# EAGLE design stm32f100 (EAGLE 6.5.0)
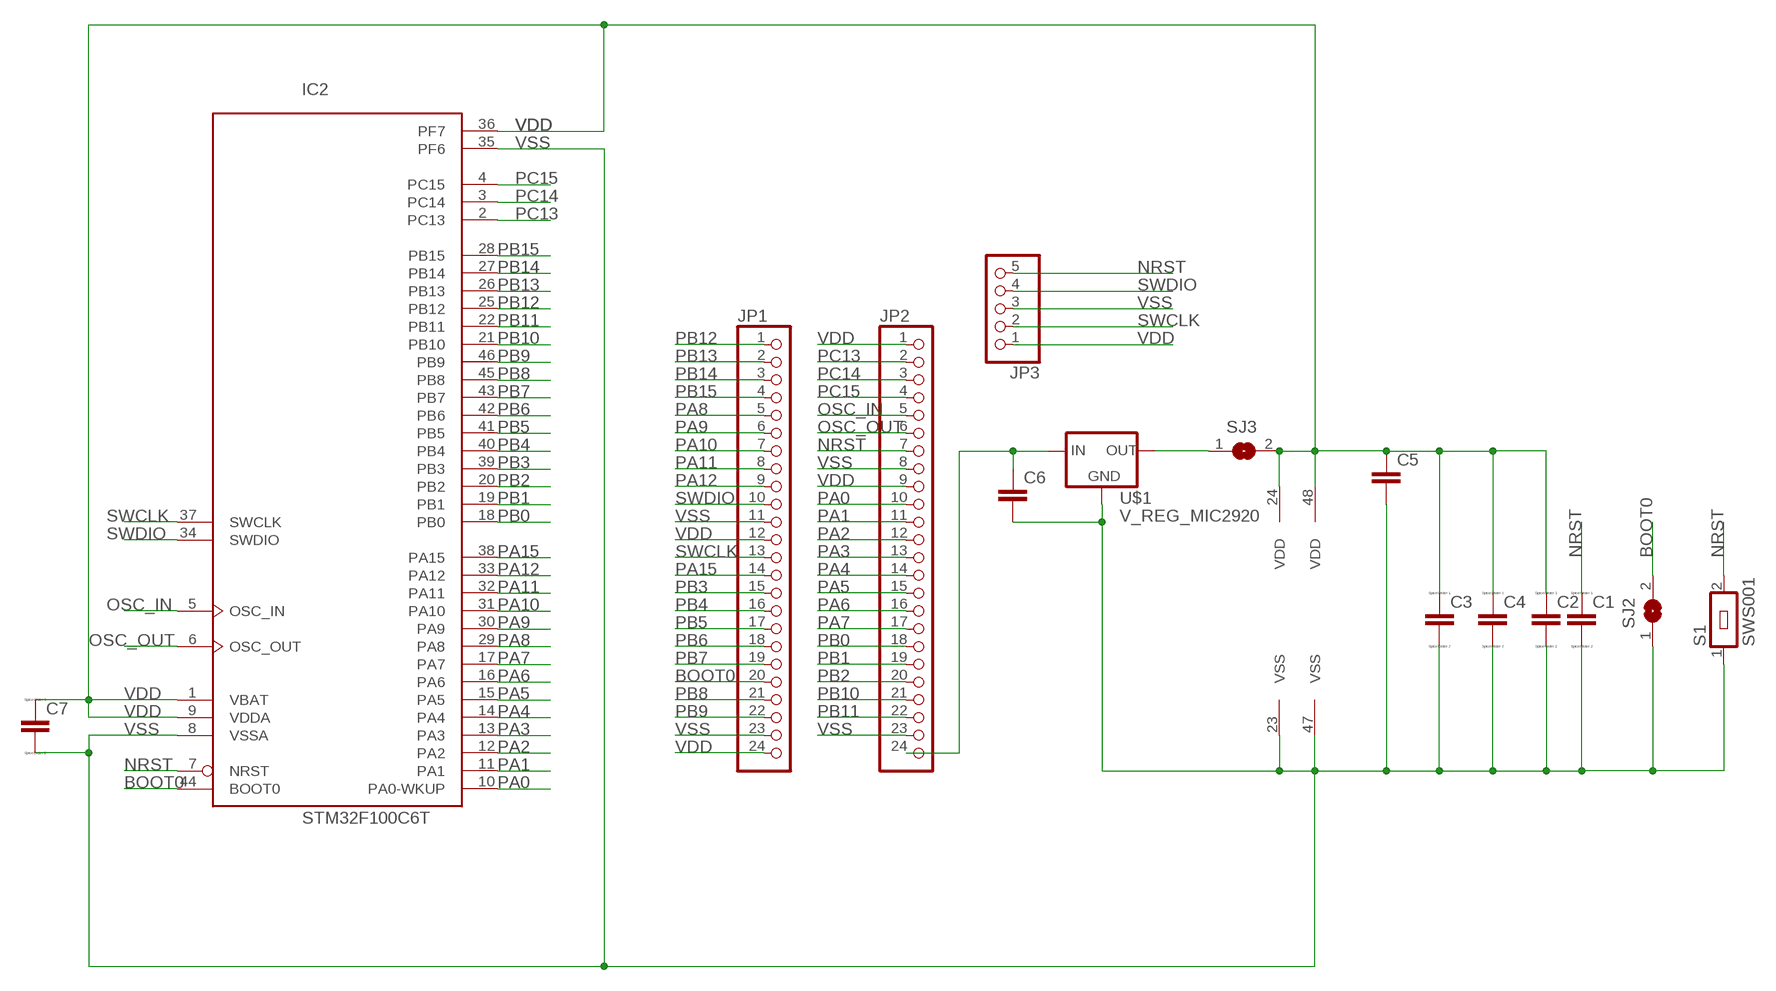
[diagram p0: schematic, sheet 1]

## Parts
C1  C-EUC0603K  [C0603K]
C2  C-EUC0603K  [C0603K]
C3  C-EUC0603K  [C0603K]
C4  C-EUC0603K  [C0603K]
C5  C-EUC1210K  [C1210K]
C6  C-EUC1210K  [C1210K]
C7  C-EUC0603K  [C0603K]
IC2  STM32F100C6T  [LQFP48]
JP1  PINHD-1X24  [1X24]
JP2  PINHD-1X24  [1X24]
JP3  PINHD-1X5  [1X05]
S1  SWS001  [SMS-001]
SJ2  SJ  [SJ]
SJ3  SJ  [SJ]
U$1  V_REG_MIC2920  [SOT223]

## Nets
BOOT0: IC2.44(BOOT0) JP1.20 SJ2.2
N$2: SJ3.1 U$1.2(OUT) U$1.4(OUT)
N$3: C6.1 JP2.24 U$1.3(IN)
NRST: C1.1 IC2.7(NRST) JP2.7 JP3.5 S1.2
OSC_IN: IC2.5(OSC_IN) JP2.5
OSC_OUT: IC2.6(OSC_OUT) JP2.6
PA0: IC2.10(PA0-WKUP) JP2.10
PA1: IC2.11(PA1) JP2.11
PA2: IC2.12(PA2) JP2.12
PA3: IC2.13(PA3) JP2.13
PA4: IC2.14(PA4) JP2.14
PA5: IC2.15(PA5) JP2.15
PA6: IC2.16(PA6) JP2.16
PA7: IC2.17(PA7) JP2.17
PA8: IC2.29(PA8) JP1.5
PA9: IC2.30(PA9) JP1.6
PA10: IC2.31(PA10) JP1.7
PA11: IC2.32(PA11) JP1.8
PA12: IC2.33(PA12) JP1.9
PA15: IC2.38(PA15) JP1.14
PB0: IC2.18(PB0) JP2.18
PB1: IC2.19(PB1) JP2.19
PB2: IC2.20(PB2) JP2.20
PB3: IC2.39(PB3) JP1.15
PB4: IC2.40(PB4) JP1.16
PB5: IC2.41(PB5) JP1.17
PB6: IC2.42(PB6) JP1.18
PB7: IC2.43(PB7) JP1.19
PB8: IC2.45(PB8) JP1.21
PB9: IC2.46(PB9) JP1.22
PB10: IC2.21(PB10) JP2.21
PB11: IC2.22(PB11) JP2.22
PB12: IC2.25(PB12) JP1.1
PB13: IC2.26(PB13) JP1.2
PB14: IC2.27(PB14) JP1.3
PB15: IC2.28(PB15) JP1.4
PC13: IC2.2(PC13) JP2.2
PC14: IC2.3(PC14) JP2.3
PC15: IC2.4(PC15) JP2.4
SWCLK: IC2.37(SWCLK) JP1.13 JP3.2
SWDIO: IC2.34(SWDIO) JP1.10 JP3.4
VDD: C2.1 C3.1 C4.1 C5.1 C7.1 IC2.1(VBAT) IC2.9(VDDA) IC2.24(VDD) IC2.36(PF7) IC2.48(VDD) JP1.12 JP1.24 JP2.1 JP2.9 JP3.1 SJ3.2
VSS: C1.2 C2.2 C3.2 C4.2 C5.2 C6.2 C7.2 IC2.8(VSSA) IC2.23(VSS) IC2.35(PF6) IC2.47(VSS) JP1.11 JP1.23 JP2.8 JP2.23 JP3.3 S1.1 SJ2.1 U$1.1(GND)

## Library data of the parts
C1-C4 C7 = resistor:C-EU: CAPACITOR, European symbol; SPICEPREFIX: C
C5 C6 = rcl:C-EU: CAPACITOR, European symbol
IC2 = reroolib:STM32F100C*T: ARM 32-bit Cortex™-M3 CPU 24 MHz maximum frequency 16 to 128 Kbytes of Flash memory 4 to 8 kbytes of SRAM 37 GPIOs 2.0 to 3.6 V application supply
JP1 JP2 = pinhead:PINHD-1X24: PIN HEADER
JP3 = pinhead:PINHD-1X5: PIN HEADER
S1 = wz:SWS001: SMD Dip Switch 1 pol.
SJ2 SJ3 = jumper:SJ: SMD solder JUMPER
U$1 = wz:V_REG_MIC2920: MIC2920A (http://www.micrel.com/_PDF/mic2920.pdf) - 400mA output LDO Regulator

## Board
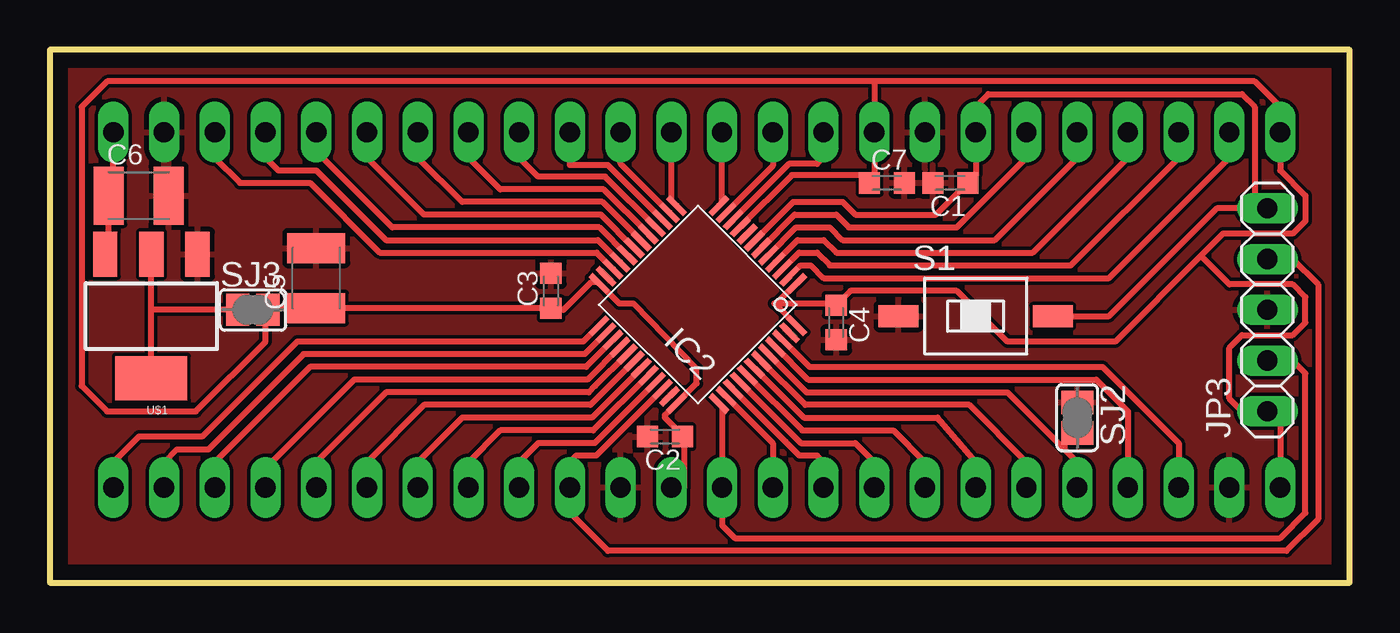
[diagram p1: board, top side]
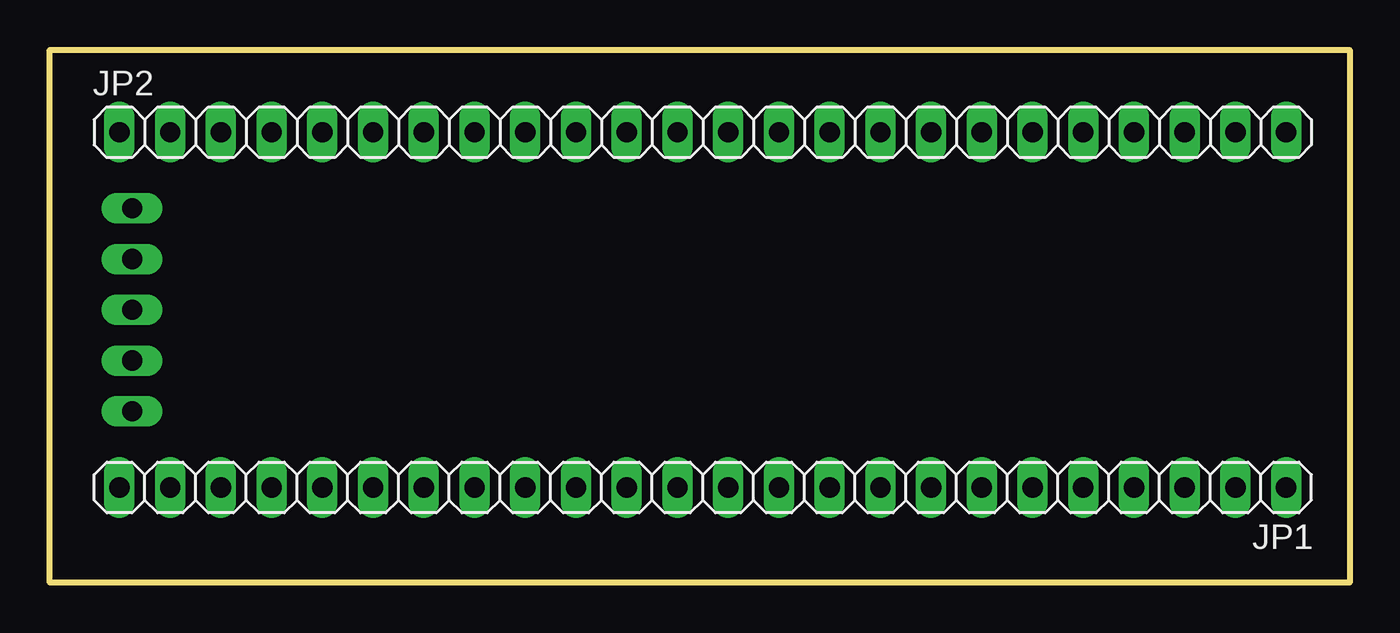
[diagram p2: board, bottom side, seen from below]

Size 65.08 x 26.66 mm. Coordinates in mm from the lower left corner, seen from the top.
Outline: 0,0 65.08,0 65.08,26.66 0,26.66 0,0
Copper layers (1*16): Top 0.035mm / dielectric 1.5mm / Bottom 0.035mm
Design rules "cnc *": minimum track width 10mil, minimum drill 0.1mm, track to track 7mil, track to pad 7mil, pad to pad 7mil, via to via 7mil, smd to smd 7mil, copper to edge 30mil, drill to drill 8mil, minimum pad ring 10mil, minimum via ring 8mil, stop-mask expansion 4mil, vias tented up to drill 0mil, thermal gap 10mil

### Footprints (pad centres in the part's own frame; a part is rotated, then mirrored left to right if it is on the bottom)
C0603K = smd 1.05 x 1.08: 1 -0.875,0; 2 0.875,0
C1210K = smd 1.5 x 2.9: 1 -1.5,0; 2 1.5,0
LQFP48 = smd 0.3 x 1.2: 1 -2.75,-4.25; 2 -2.25,-4.25; 3 -1.75,-4.25; 4 -1.25,-4.25; 5 -0.75,-4.25; 6 -0.25,-4.25; 7 0.25,-4.25; 8 0.75,-4.25; 9 1.25,-4.25; 10 1.75,-4.25; 11 2.25,-4.25; 12 2.75,-4.25; 25 2.75,4.25; 26 2.25,4.25; 27 1.75,4.25; 28 1.25,4.25; 29 0.75,4.25; 30 0.25,4.25; 31 -0.25,4.25; 32 -0.75,4.25; 33 -1.25,4.25; 34 -1.75,4.25; 35 -2.25,4.25; 36 -2.75,4.25 | smd 1.2 x 0.3: 13 4.25,-2.75; 14 4.25,-2.25; 15 4.25,-1.75; 16 4.25,-1.25; 17 4.25,-0.75; 18 4.25,-0.25; 19 4.25,0.25; 20 4.25,0.75; 21 4.25,1.25; 22 4.25,1.75; 23 4.25,2.25; 24 4.25,2.75; 37 -4.25,2.75; 38 -4.25,2.25; 39 -4.25,1.75; 40 -4.25,1.25; 41 -4.25,0.75; 42 -4.25,0.25; 43 -4.25,-0.25; 44 -4.25,-0.75; 45 -4.25,-1.25; 46 -4.25,-1.75; 47 -4.25,-2.25; 48 -4.25,-2.75
1X24 = drill 1.016 long: 1 -29.21,0; 2 -26.67,0; 3 -24.13,0; 4 -21.59,0; 5 -19.05,0; 6 -16.51,0; 7 -13.97,0; 8 -11.43,0; 9 -8.89,0; 10 -6.35,0; 11 -3.81,0; 12 -1.27,0; 13 1.27,0; 14 3.81,0; 15 6.35,0; 16 8.89,0; 17 11.43,0; 18 13.97,0; 19 16.51,0; 20 19.05,0; 21 21.59,0; 22 24.13,0; 23 26.67,0; 24 29.21,0
1X05 = drill 1.016 long: 1 -5.08,0; 2 -2.54,0; 3 0,0; 4 2.54,0; 5 5.08,0
SMS-001 = smd 1.092 x 2.007: 1 0,-3.861; 2 0,3.861
SJ = smd 1.168 x 1.6: 1 -0.762,0; 2 0.762,0
SOT223 = smd 1.219 x 2.235: 1 -2.311,-3.099; 2 0,-3.099; 3 2.311,-3.099 | smd 3.6 x 2.2: 4 0,3.099

### Placement (x,y rotation side)
C1  45.09,20 180 top
C2  30.8,7.3 180 top
C3  25.08,14.61 90 top
C4  39.37,13.02 270 top
C5  13.34,15.24 90 top
C6  4.45,19.37 0 top
C7  41.91,20 0 top
IC2  32.44,13.92 135 top
JP1  32.38,4.76 180 bottom
JP2  32.38,22.54 0 bottom
JP3  60.96,13.65 90 top
S1  46.35,13.34 270 top
SJ2  51.44,8.26 270 top
SJ3  10.16,13.65 0 top
U$1  5.08,13.34 180 top

### Tracks (layer width: path | path; a pad name or v marks a point on that pad's centre or on a via)
BOOT0
  Top 0.305: IC2.44 37.89,9.53 47.94,9.53 50.8,6.67 | JP1.20 51.44,6.03 50.8,6.67 | SJ2.2 50.8,7.49 50.8,6.67
N$1
  Top 0.305: 51.44,8.89 51.44,7.62
N$2
  Top 0.305: U$1.4 5.08,13.65 | 5.08,13.65 U$1.2 | SJ3.1 5.08,13.65
N$3
  Top 0.305: U$1.3 2.94,16.29 C6.1 3.17,19.6 JP2.24
NRST
  Top 0.305: IC2.7 37.22,19.05 39.69,19.05 40.32,18.41 44.37,18.41 C1.1 46.35,20.4 JP2.7 46.35,23.81 46.99,24.45 59.69,24.45 60.33,23.81 60.33,18.73 | JP3.5 60.33,18.73 | 60.33,18.73 58.42,18.73 53.02,13.34 S1.2
OSC_IN
  Top 0.305: JP2.5 51.44,21.27 47.31,17.14 39.69,17.14 39.05,17.78 37.37,17.78 IC2.5
OSC_OUT
  Top 0.305: JP2.6 48.9,21.27 45.4,17.78 40.01,17.78 39.37,18.41 37.29,18.41 IC2.6
PA0
  Top 0.305: JP2.10 38.73,21.27 38.42,20.95 37,20.95 IC2.10
PA1
  Top 0.305: JP2.11 36.2,20.85 IC2.11
PA2
  Top 0.305: JP2.12 33.66,19.02 IC2.12
PA3
  Top 0.305: JP2.13 31.11,19.13 IC2.13
PA4
  Top 0.305: JP2.14 28.57,20.96 IC2.14
PA5
  Top 0.305: JP2.15 26.04,20.89 27.94,20.89 IC2.15
PA6
  Top 0.305: 27.8,20.32 24.45,20.32 23.5,21.27 JP2.16 | IC2.16 27.8,20.32 | 27.8,20.32
PA7
  Top 0.305: 27.73,19.68 22.54,19.68 20.95,21.27 JP2.17 | IC2.17 27.73,19.68 | 27.73,19.68
PA8
  Top 0.305: JP1.5 13.34,6.03 16.83,9.53 26.99,9.53 27.31,9.84 IC2.29
PA9
  Top 0.305: JP1.6 15.88,6.03 18.73,8.89 27.06,8.89 IC2.30
PA10
  Top 0.305: JP1.7 18.41,6.03 20.64,8.26 27.13,8.26 IC2.31
PA11
  Top 0.305: JP1.8 20.95,6.03 22.54,7.62 27.2,7.62 IC2.32
PA12
  Top 0.305: JP1.9 23.5,6.03 24.45,6.99 27.28,6.99 IC2.33
PA15
  Top 0.305: 36.2,5.39 JP1.14 | IC2.38 36.2,6.99 36.2,5.39 | 36.2,5.39
PB0
  Top 0.305: 27.66,19.05 20.64,19.05 18.41,21.27 JP2.18 | IC2.18 27.66,19.05 | 27.66,19.05
PB1
  Top 0.305: 27.59,18.41 18.73,18.41 15.88,21.27 JP2.19 | IC2.19 27.59,18.41 | 27.59,18.41
PB2
  Top 0.305: 27.51,17.78 17.14,17.78 13.34,21.59 JP2.20 | IC2.20 27.51,17.78 | 27.51,17.78
PB3
  Top 0.305: JP1.15 38.73,6.03 38.42,6.35 37.53,6.35 37.15,6.73 36.83,7.05 IC2.39
PB4
  Top 0.305: JP1.16 41.27,6.03 40.32,6.99 37.6,6.99 IC2.40
PB5
  Top 0.305: JP1.17 43.81,6.03 42.23,7.62 37.67,7.62 IC2.41
PB6
  Top 0.305: JP1.18 46.35,6.03 44.45,8.26 37.75,8.26 IC2.42
PB7
  Top 0.305: JP1.19 48.9,6.03 46.04,8.89 37.82,8.89 IC2.43
PB8
  Top 0.305: IC2.45 37.96,10.16 52.39,10.16 53.98,8.57 JP1.21
PB9
  Top 0.305: IC2.46 38.03,10.79 52.7,10.79 56.52,6.99 JP1.22
PB10
  Top 0.305: JP2.21 10.79,21.27 11.43,20.64 13.34,20.64 16.83,17.14 27.44,17.14 | IC2.21 27.44,17.14 | 27.44,17.14
PB11
  Top 0.305: JP2.22 8.26,21.27 9.53,20 13.02,20 16.51,16.51 27.37,16.51 IC2.22
PB12
  Top 0.305: JP1.1 3.17,6.03 4.45,7.3 7.62,7.3 12.38,12.06 26.7,12.06 IC2.25
PB13
  Top 0.305: JP1.2 5.71,6.03 6.35,6.67 7.94,6.67 12.7,11.43 26.77,11.43 IC2.26
PB14
  Top 0.305: JP1.3 8.26,6.03 13.02,10.79 26.84,10.79 IC2.27
PB15
  Top 0.305: JP1.4 10.79,5.71 15.24,10.16 26.92,10.16 IC2.28
PC13
  Top 0.305: JP2.2 59.05,21.27 53.02,15.24 38.73,15.24 38.1,15.88 37.58,15.88 IC2.2
PC14
  Top 0.305: JP2.3 56.52,21.27 51.12,15.88 39.05,15.88 38.42,16.51 37.51,16.51 IC2.3
PC15
  Top 0.305: JP2.4 53.98,21.27 49.21,16.51 39.37,16.51 38.73,17.14 37.44,17.14 IC2.4
SWCLK
  Top 0.305: IC2.37 33.66,8.81 JP1.13 33.66,2.86 34.29,2.22 61.59,2.22 62.87,3.49 62.87,10.48 62.23,11.11 JP3.2
SWDIO
  Top 0.305: IC2.34 27.35,6.35 26.35,6.35 26.04,6.03 JP1.10 26.04,3.49 27.94,1.59 61.91,1.59 63.5,3.17 63.5,14.92 62.23,16.19 JP3.4
VDD
  Top 0.305: JP1.24 61.59,7.94 JP3.1 59.69,8.57 59.05,9.21 59.05,11.75 59.69,12.38 62.23,12.38 62.87,13.02 62.87,14.29 62.23,14.92 59.05,14.92 57.63,16.35 | 41.27,20.4 JP2.9 41.27,25.08 | 41.27,20.4 37.15,20.4 IC2.9 | 57.63,16.35 58.74,17.46 62.23,17.46 62.87,18.1 62.87,19.37 61.59,20.64 JP2.1 61.59,23.81 60.33,25.08 41.27,25.08 | 57.63,16.35 53.34,12.06 47.94,12.06 45.4,14.61 40.08,14.61 C4.1 39.29,13.97 36.38,13.97 | IC2.1 36.38,13.97 | 36.38,13.97 36.27,13.97 IC2.48 | 41.27,20.4 41.03,20.16 C7.1 | 41.27,25.08 2.86,25.08 1.59,23.81 1.59,9.84 2.86,8.57 7.3,8.57 10.79,12.06 10.79,13.53 SJ3.2 11.01,13.74 C5.1 14.3,13.73 C3.1 25.32,13.65 25.72,13.65 27.1,15.03 27.43,15.03 IC2.24 28.5,13.97 29.21,13.97 32.38,10.72 32.38,9.97 IC2.36 30.8,8.38 30.8,8.26 31.67,7.38 C2.1 31.75,7.22 31.75,4.76 JP1.12
VSS
  pour Top: 64.77,0.32 64.77,26.35 0.32,26.35 0.32,0.32